# Altium project Project_SensorTapeMaster_v1.PrjPcb
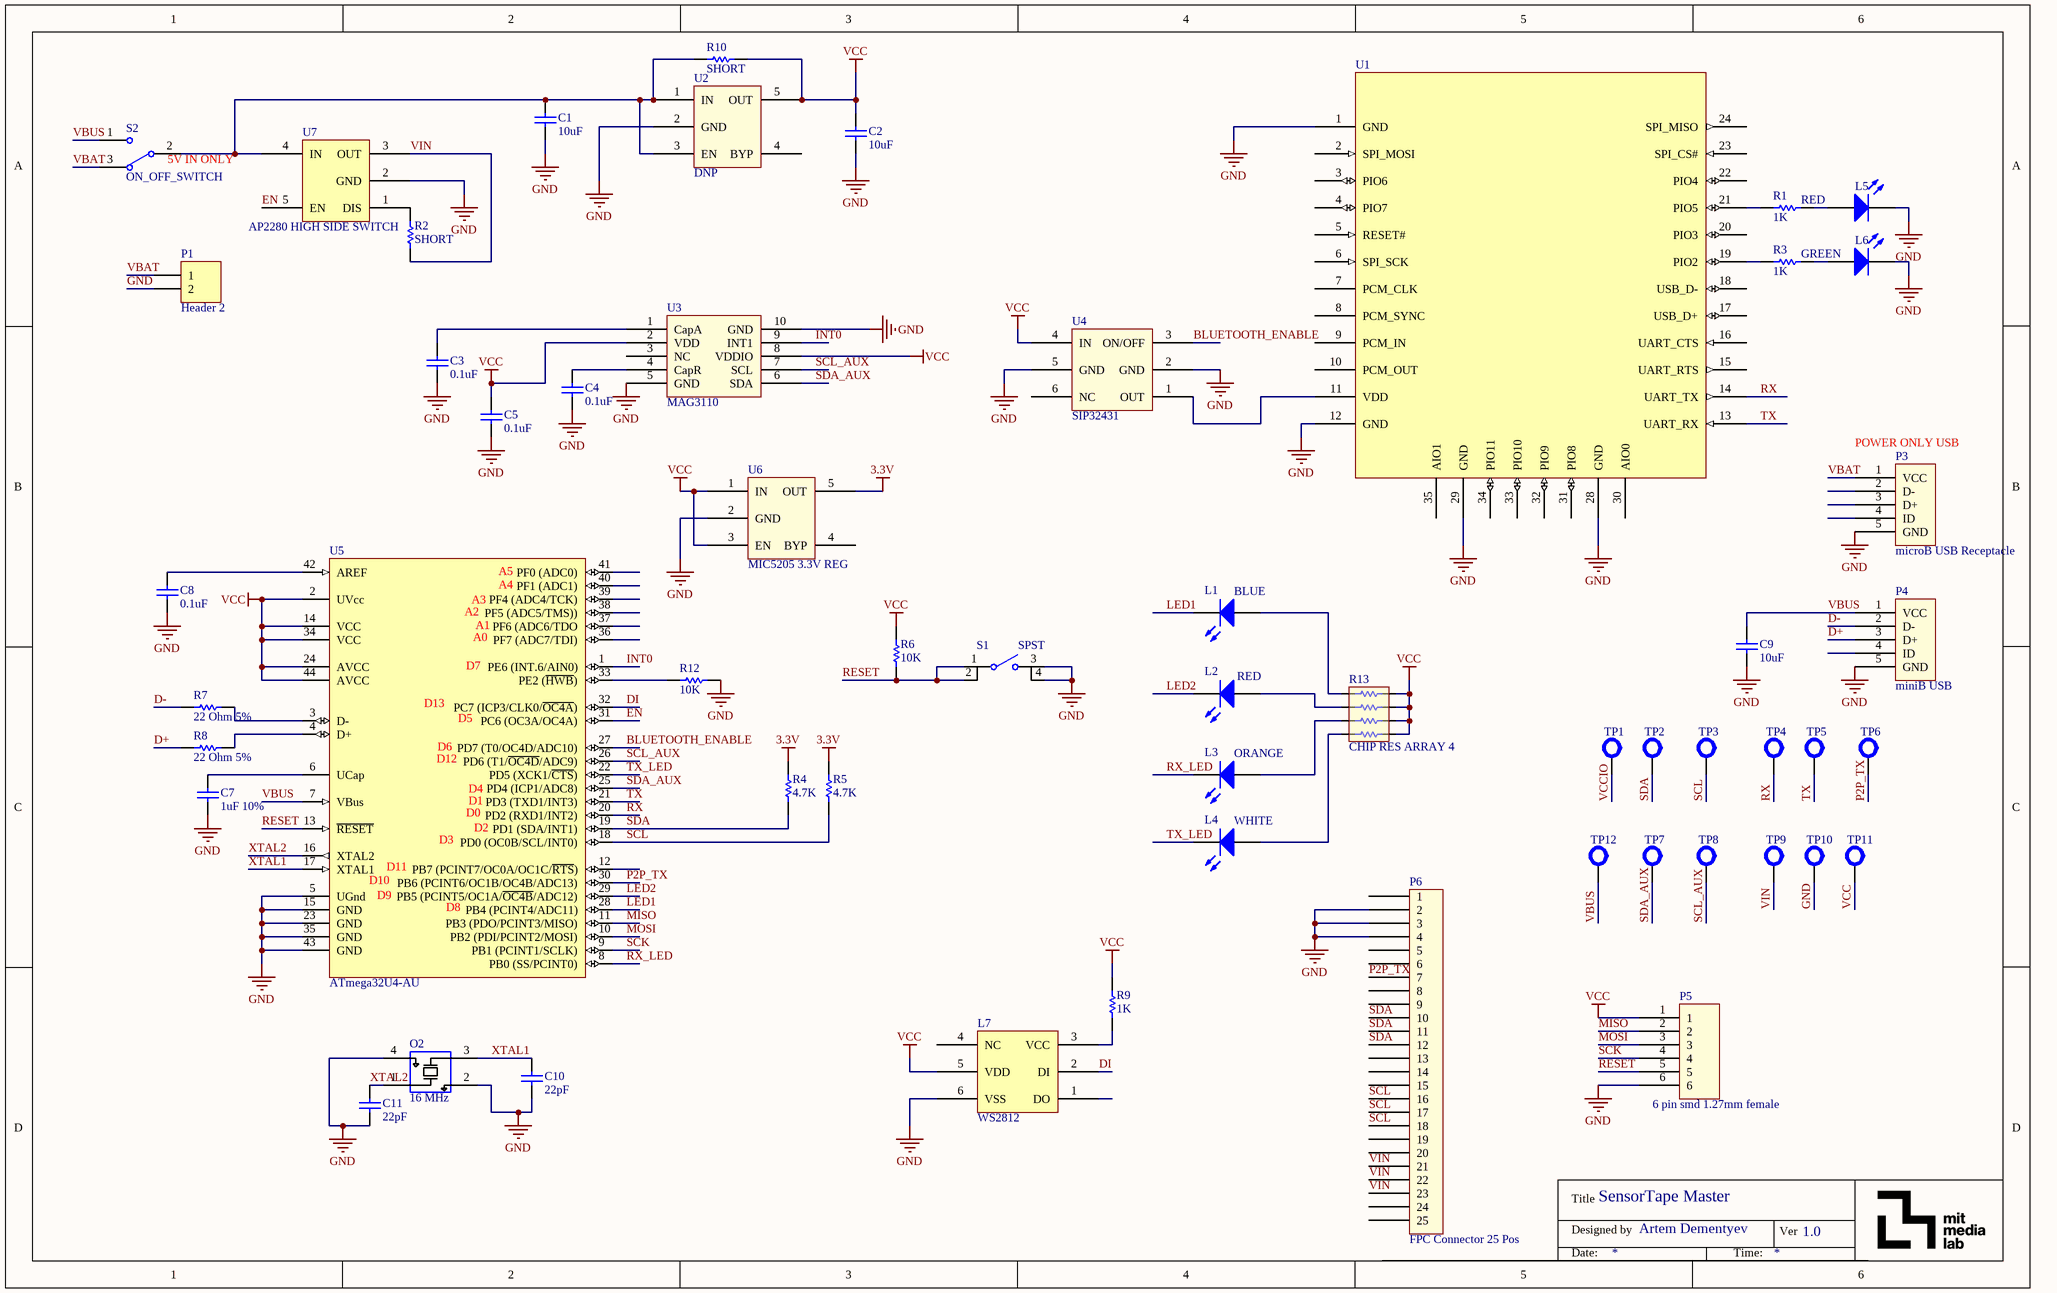
[diagram p0: Schematic_SensorTapeMaster_v1.SchDoc]
1 sheet, 56 parts. Net scope: global (net labels, ports and power ports of the same name join across sheets).
Board file: PCB_SensorTapeMaster_v1.PcbDoc

## Sheet Schematic_SensorTapeMaster_v1.SchDoc: SensorTape Master
size B; Author: Artem Dementyev; Revision: 1.0

### Parts
C1  10uF  [0603W]
C2  10uF  [0603W]
C3  0.1uF  [0603W]
C4  0.1uF  [0603W]
C5  0.1uF  [0603W]
C7  1uF 10%  [0603W]
C8  0.1uF  [0603W]
C9  10uF  [0603W]
C10  22pF  [0603W]
C11  22pF  [0603W]
L1  BLUE  [0603W]
L2  RED  [0603W]
L3  ORANGE  [0603W]
L4  WHITE  [0603W]
L5  LED  [0603W]  (value not drawn)
L6  LED  [0603W]  (value not drawn)
L7  WS2812  [WS2812]
O2  16 MHz  [CRYSTAL_SMD]
P1  Header 2  [HDR1X2]
P3  microB USB Receptacle  [MicroB USB Standarad SMT]
P4  miniB USB  [UX60SC-MB-5ST]
P5  6 pin smd 1.27mm female  [6pos 1.27mm]
P6  FPC Connector 25 Pos  [FPC 25 POS]
R1  1K  [0603W]
R2  SHORT  [0603W]
R3  1K  [0603W]
R4  4.7K  [0603W]
R5  4.7K  [0603W]
R6  10K  [0603W]
R7  22 Ohm 5%  [0603W]
R8  22 Ohm 5%  [0603W]
R9  1K  [0603W]
R10  SHORT  [0603W]
R12  10K  [0603W]
R13  CHIP RES ARRAY 4  [RES ARRAY 4 1206]
S1  SPST  [EVQQ2 Switch]
S2  ON_OFF_SWITCH  [SS321 Switch]
TP1  Test point small  [Test point small]  (value not drawn)
TP2  Test point small  [Test point small]  (value not drawn)
TP3  Test point small  [Test point small]  (value not drawn)
TP4  Test point small  [Test point small]  (value not drawn)
TP5  Test point small  [Test point small]  (value not drawn)
TP6  Test point small  [Test point small]  (value not drawn)
TP7  Test point small  [Test point small]  (value not drawn)
TP8  Test point small  [Test point small]  (value not drawn)
TP9  Test point small  [Test point small]  (value not drawn)
TP10  Test point small  [Test point small]  (value not drawn)
TP11  Test point small  [Test point small]  (value not drawn)
TP12  Test point small  [Test point small]  (value not drawn)
U1  (no value)  [RN-42 LAND]
U2  DNP  [SOT-23-5]
U3  MAG3110  [10-VFDFN]
U4  SIP32431  [SOT363]
U5  ATmega32U4-AU  [44ML_N]
U6  MIC5205 3.3V REG  [SOT-23-5]
U7  AP2280 HIGH SIDE SWITCH  [SOT25]

### Nets
3.3V: R4.1 R5.2 U6.5(OUT)
GND: C1.1 C2.1 C3.1 C4.1 C5.1 C7.2 C8.2 C9.2 C10.2 C11.2 L5.2(K) L6.2(K) L7.6(VSS) O2.2(Gnd) O2.4(Gnd) P1.2 P3.5(GND) P4.5(GND) P5.6 P6.2 P6.3 P6.4 R12.1 S1.3 S1.4 TP10.0 U1.1(GND) U1.12(GND) U1.28(GND) U1.29(GND) U2.2(GND) U3.5(GND) U3.10(GND) U4.2(GND) U4.5(GND) U5.5(UGnd) U5.15(GND) U5.23(GND) U5.35(GND) U5.43(GND) U6.2(GND) U7.2(GND)
VCC: C2.2 C5.2 L7.5(VDD) P5.1 R6.2 R9.2 R10.1 R13.5 R13.6 R13.7 R13.8 TP11.0 U2.5(OUT) U3.2(VDD) U3.8(VDDIO) U4.4(IN) U5.2(UVcc) U5.14(VCC) U5.24(AVCC) U5.34(VCC) U5.44(AVCC) U6.1(IN) U6.3(EN)
BLUETOOTH_ENABLE: U4.3(ON/OFF) U5.27(PD7_(T0/OC4D/ADC10))
D+: P4.3(D+) R8.2
D-: P4.2(D-) R7.2
DI: L7.2(DI) U5.32(PC7_(ICP3/CLK0/~{OC4A}))
EN: U5.31(PC6_(OC3A/OC4A)) U7.5(EN)
INT0: U3.9(INT1) U5.1(PE6_(INT.6/AIN0))
LED1: L1.2(K) U5.28(PB4_(PCINT4/ADC11))
LED2: L2.2(K) U5.29(PB5_(PCINT5/OC1A/~{OC4B}/ADC12))
MISO: P5.2 U5.11(PB3_(PDO/PCINT3/MISO))
MOSI: P5.3 U5.10(PB2_(PDI/PCINT2/MOSI))
P2P_TX: P6.7 TP6.0 U5.30(PB6_(PCINT6/OC1B/OC4B/ADC13))
RESET: P5.5 R6.1 S1.1(COMMON) S1.2 U5.13(~{RESET})
RX: TP4.0 U1.14(UART_TX) U5.20(PD2_(RXD1/INT2))
RX_LED: L3.2(K) U5.8(PB0_(SS/PCINT0))
SCK: P5.4 U5.9(PB1_(PCINT1/SCLK))
SCL: P6.16 P6.17 P6.18 R5.1 TP3.0 U5.18(PD0_(OC0B/SCL/INT0))
SCL_AUX: TP8.0 U3.7(SCL) U5.26(PD6_(T1/~{OC4D}/ADC9))
SDA: P6.10 P6.11 P6.12 R4.2 TP2.0 U5.19(PD1_(SDA/INT1))
SDA_AUX: TP7.0 U3.6(SDA) U5.25(PD4_(ICP1/ADC8))
TX: TP5.0 U1.13(UART_RX) U5.21(PD3_(TXD1/INT3))
TX_LED: L4.2(K) U5.22(PD5_(XCK1/~{CTS}))
VBAT: P1.1 P3.1(VCC) S2.3
VBUS: C9.1 P4.1(VCC) S2.1 TP12.0 U5.7(VBus)
VCCIO: TP1.0
VIN: P6.21 P6.22 P6.23 R2.1 TP9.0 U7.3(OUT)
XTAL1: C10.1 O2.3(XOUT) U5.17(XTAL1)
XTAL2: C11.1 O2.1(XIN) U5.16(XTAL2)
NetC1_2: C1.2 R10.2 S2.2 U2.1(IN) U2.3(EN) U7.4(IN)
NetC3_2: C3.2 U3.1(CapA)
NetC4_2: C4.2 U3.4(CapR)
NetC7_1: C7.1 U5.6(UCap)
NetC8_1: C8.1 U5.42(AREF)
NetL1_1: L1.1(A) R13.1
NetL2_1: L2.1(A) R13.2
NetL3_1: L3.1(A) R13.3
NetL4_1: L4.1(A) R13.4
NetL5_1: L5.1(A) R1.1
NetL6_1: L6.1(A) R3.1
NetL7_3: L7.3(VCC) R9.1
NetR1_2: R1.2 U1.21(PIO5)
NetR2_2: R2.2 U7.1(DIS)
NetR3_2: R3.2 U1.19(PIO2)
NetR7_1: R7.1 U5.3(D-)
NetR8_1: R8.1 U5.4(D+)
NetR12_2: R12.2 U5.33(PE2_(~{HWB}))
NetU1_11: U1.11(VDD) U4.1(OUT)

Not connected (* = marked no-connect by the designer): L7 1(DO) 4(NC); P3 2(D-) 3(D+) 4(ID); P4 4(ID); P6 1 5 6 8 9 13 14 15 19 20 24 25; U1 2(SPI_MOSI) 3(PIO6) 4(PIO7) 5(RESET#) 6(SPI_SCK) 7(PCM_CLK) 8(PCM_SYNC) 9(PCM_IN) 10(PCM_OUT) 15(UART_RTS) 16(UART_CTS) 17(USB_D+) 18(USB_D-) 20(PIO3) 22(PIO4) 23(SPI_CS#) 24(SPI_MISO) 30(AIO0) 31(PIO8) 32(PIO9) 33(PIO10) 34(PIO11) 35(AIO1); U2 4(BYP); U3 3(NC); U4 6(NC); U5 12(PB7_(PCINT7/OC0A/OC1C/~{RTS})) 36(PF7_(ADC7/TDI)) 37(PF6_(ADC6/TDO) 38(PF5_(ADC5/TMS))) 39(PF4_(ADC4/TCK)) 40(PF1_(ADC1)) 41(PF0_(ADC0)); U6 4(BYP)

### Notes on the sheet
- (near S2) 5V IN ONLY
- (near R1) RED
- (near R3) GREEN
- (near P3) POWER ONLY USB
- (near U5) A2
- (near U5) A3
- (near U5) A0
- (near U5) A1
- (near U5) A5
- (near U5) A4
- (near U5) D13
- (near U5) D7
- (near U5) D12
- (near U5) D6
- (near U5) D5
- (near U5) D3
- (near U5) D0
- (near U5) D4
- (near U5) D1
- (near U5) D2
- (near U5) D10
- (near U5) D9
- (near U5) D11
- (near U5) D8
- Title
- Designed by
- Ver
- Date:
- Time:

### Library data of the parts
C1-C5 C7-C11 = Capacitor: SMD Cap 1206; digikey number: 587-3383-1-ND
L1-L6 = LED: LED SMD 1206/0603; Sparkfun green: PRT-12622; Sparkfun blue: PRT-12620
  L1: digikey number: 160-1647-1-ND
  L2: digikey number: 160-1447-1-ND
  L3: digikey number: 160-1445-1-ND
  L4: digikey number: 160-1721-1-ND
  L5: digikey part number: 160-1447-1-ND
  L6: digikey part number: 160-1446-1-ND
L7 = WS2812: adafruit: 1379
O2 = Crystal_SMD: Surface mount crystal; Sparkfun # for 16 MHz: COM-00094; digikey number: CTX820CT-ND
P1 = Header 2: Header, 2-Pin; LatestRevisionDate: 17-Jul-2002; LatestRevisionNote: Re-released for DXP Platform.; Publisher: Altium Limited
P3 = microB USB Receptacle: Manufacturer: ZX62-B-5PA(11); Digikey: H11634CT-ND
R1-R10 R12 = Resistor
  R2 R4-R10 R12: digikey number: RMCF0603FT10K0CT-ND
S1 = SPST: THD Button Switch; Sparkfun #: COM-00097
S2 = ON_OFF_SWITCH: SPDT SMD Side Switch; Sparkfun#: COM-00597; digikey number: 563-1102-1-ND; digikey 2: 360-2924-1-ND
U1 = RN42: Bluetooth serial modem; Digikey part number: 740-1038-ND
U2 U6 = MIC5205_VOLTAGE_REG: 5V LDO SMD; Sparkfun #: PRT-1125; digikey number: 576-1259-1-ND
U4 = SIP32431: High side switch; Digikey part number: SIP32431DR3-T1GE3CT-ND
U5 = ATmega32U4-AU: 8-bit AVR Microcontroller, 2.7-5.5V, 32KB Flash, 2.5KB EEPROM, 1KB SRAM, USB Controller, 44-pin TQFP, Industrial Grade (-40°C to 85°C); Published: 1-Apr-2010; DatasheetVersion: revD, Jan-2009; PackageVersion: rev.G, Jul-2007; PackageReference: 44ML; Publisher: Altium Limited; PackageDescription: 44-Pin Plastic Thin Quad Flat Pack, 10 x 10 x 1.0 mm Body, 0.8 mm Pitch (TQFP); Supplier 1: Digi-Key; Supplier Part Number 1: ATMEGA32U4-AU-ND; Supplier 2: Farnell; Supplier Part Number 2: 1748525; Supplier 3: Mouser; Supplier Part Number 3: 556-ATMEGA32U4-AU; ComponentLink1Description: Manufacturer Link; ComponentLink1URL: http://www.atmel.com/products/avr/default.asp?; ComponentLink2Description: ATmega16U4/32U4 Datasheet; ComponentLink2URL: http://www.atmel.com/dyn/resources/prod_documents/doc7766.pdf; ComponentLink3Description: ATmega16U4 ATmega32U4 Summary; ComponentLink3URL: http://www.atmel.com/dyn/resources/prod_documents/7766S.pdf; ComponentLink4Description: Atmel.com Home; ComponentLink4URL: http://www.atmel.com
U7 = AP2280 HIGH SIDE SWITCH: 2A High side switch; digikey number: AP2280-1WGDICT-ND
P4 = miniB USB: digikey number: H11671CT-ND
P5 = 6 pin smd 1.27mm female: digikey number: ED90490-ND
P6 = FPC Connector 25 Pos: digikey part number: A101410CT-ND
R13 = CHIP RES ARRAY 4: digikey number: Y7331CT-ND; digikey number 1206: Y9331CT-ND
TP1-TP12 = Test point small: digikey number: 5000K-ND
U3 = MAG3110: digikey number: MAG3110FCR1CT-ND